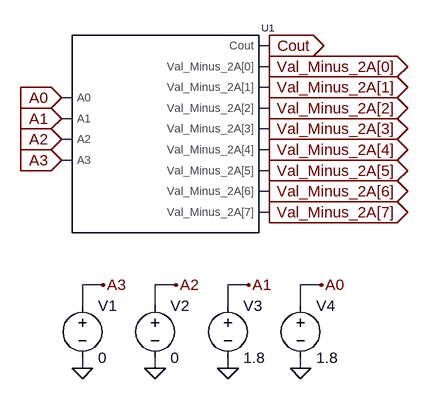
[diagram p0: schematic Val_Minus_2A_Test.asc]
Val_Minus_2A_Test.asc, the LTspice schematic file:
Version 4
SHEET 1 880 680
WIRE 384 16 368 16
WIRE 384 48 368 48
WIRE 384 80 368 80
WIRE 80 96 64 96
WIRE 384 112 368 112
WIRE 80 128 64 128
WIRE 384 144 368 144
WIRE 80 160 64 160
WIRE 384 176 368 176
WIRE 80 192 64 192
WIRE 384 208 368 208
WIRE 384 240 368 240
WIRE 384 272 368 272
WIRE 128 384 96 384
WIRE 240 384 208 384
WIRE 352 384 320 384
WIRE 464 384 432 384
WIRE 96 416 96 384
WIRE 208 416 208 384
WIRE 320 416 320 384
WIRE 432 416 432 384
WIRE 96 512 96 496
WIRE 208 512 208 496
WIRE 320 512 320 496
WIRE 432 512 432 496
FLAG 384 16 Cout
IOPIN 384 16 Out
FLAG 384 48 Val_Minus_2A[0]
IOPIN 384 48 Out
FLAG 384 80 Val_Minus_2A[1]
IOPIN 384 80 Out
FLAG 384 112 Val_Minus_2A[2]
IOPIN 384 112 Out
FLAG 384 144 Val_Minus_2A[3]
IOPIN 384 144 Out
FLAG 384 176 Val_Minus_2A[4]
IOPIN 384 176 Out
FLAG 384 208 Val_Minus_2A[5]
IOPIN 384 208 Out
FLAG 384 240 Val_Minus_2A[6]
IOPIN 384 240 Out
FLAG 384 272 Val_Minus_2A[7]
IOPIN 384 272 Out
FLAG 64 96 A0
IOPIN 64 96 In
FLAG 64 128 A1
IOPIN 64 128 In
FLAG 64 160 A2
IOPIN 64 160 In
FLAG 64 192 A3
IOPIN 64 192 In
FLAG 96 512 0
FLAG 128 384 A3
FLAG 208 512 0
FLAG 240 384 A2
FLAG 320 512 0
FLAG 352 384 A1
FLAG 432 512 0
FLAG 464 384 A0
SYMBOL Val_Minus_2A 144 192 R0
SYMATTR InstName U1
SYMBOL voltage 96 400 R0
WINDOW 123 0 0 Left 0
WINDOW 39 0 0 Left 0
SYMATTR InstName V1
SYMATTR Value 0
SYMBOL voltage 208 400 R0
WINDOW 123 0 0 Left 0
WINDOW 39 0 0 Left 0
SYMATTR InstName V2
SYMATTR Value 0
SYMBOL voltage 320 400 R0
WINDOW 123 0 0 Left 0
WINDOW 39 0 0 Left 0
SYMATTR InstName V3
SYMATTR Value 1.8
SYMBOL voltage 432 400 R0
WINDOW 123 0 0 Left 0
WINDOW 39 0 0 Left 0
SYMATTR InstName V4
SYMATTR Value 1.8

The netlist it stands for:
* Val_Minus_2A_Test.asc
XU1 A0 A1 A2 A3 Cout Val_Minus_2A[0] Val_Minus_2A[1] Val_Minus_2A[2] Val_Minus_2A[3] Val_Minus_2A[4] Val_Minus_2A[5] Val_Minus_2A[6] Val_Minus_2A[7] Val_Minus_2A  ; pins A0 A1 A2 A3 Cout Val_Minus_2A[0] Val_Minus_2A[1] Val_Minus_2A[2] Val_Minus_2A[3] Val_Minus_2A[4] Val_Minus_2A[5] Val_Minus_2A[6] Val_Minus_2A[7]
V1 A3 0 0
V2 A2 0 0
V3 A1 0 1.8
V4 A0 0 1.8
.lib Val_Minus_2A.sub
.backanno
.end